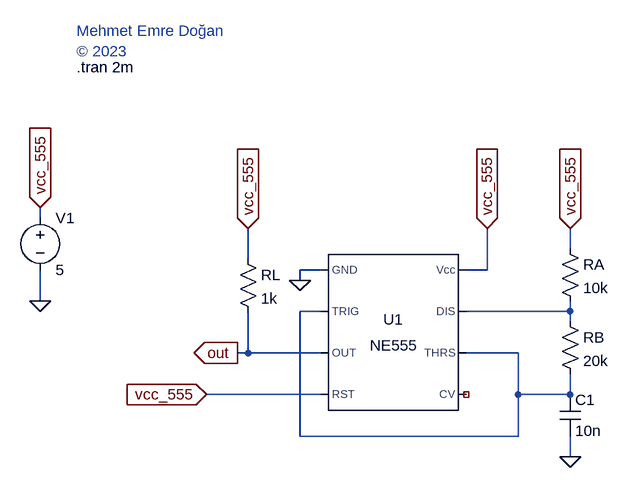
[diagram p0: schematic 555vibrator_10k_20k.asc]
555vibrator_10k_20k.asc, the LTspice schematic file:
Version 4
SHEET 1 880 680
WIRE -304 0 -304 -16
WIRE 512 48 512 16
WIRE 16 64 16 16
WIRE 128 80 96 80
WIRE 384 80 384 16
WIRE 384 80 352 80
WIRE 96 96 96 80
WIRE -304 128 -304 80
WIRE 128 144 96 144
WIRE 512 144 512 128
WIRE 512 144 352 144
WIRE 512 160 512 144
WIRE 16 208 16 144
WIRE 16 208 0 208
WIRE 128 208 16 208
WIRE 432 208 352 208
WIRE 128 272 -48 272
WIRE 432 272 432 208
WIRE 512 272 512 240
WIRE 512 272 432 272
WIRE 96 336 96 144
WIRE 432 336 432 272
WIRE 432 336 96 336
WIRE 512 368 512 336
FLAG -304 128 0
FLAG -304 -16 vcc_555
IOPIN -304 -16 In
FLAG 96 96 0
FLAG 384 16 vcc_555
IOPIN 384 16 In
FLAG 16 16 vcc_555
IOPIN 16 16 In
FLAG 0 208 out
IOPIN 0 208 Out
FLAG -48 272 vcc_555
IOPIN -48 272 In
FLAG 512 368 0
FLAG 512 16 vcc_555
IOPIN 512 16 In
SYMBOL Misc\\NE555 240 176 R0
SYMATTR InstName U1
SYMBOL voltage -304 -16 R0
SYMATTR InstName V1
SYMATTR Value 5
SYMBOL res 0 48 R0
SYMATTR InstName RL
SYMATTR Value 1k
SYMBOL res 496 32 R0
SYMATTR InstName RA
SYMATTR Value 10k
SYMBOL res 496 144 R0
SYMATTR InstName RB
SYMATTR Value 20k
SYMBOL cap 496 272 R0
SYMATTR InstName C1
SYMATTR Value 10n
TEXT -248 -288 Left 2 ;Mehmet Emre Doğan\n© 2023
TEXT -248 -232 Left 2 !.tran 2m

The netlist it stands for:
* 555vibrator_10k_20k.asc
XU1 0 N001 out vcc_555 NC_01 N001 N002 vcc_555 NE555  ; pins GND TRIG OUT RST CV THRS DIS Vcc
V1 vcc_555 0 5
RL vcc_555 out 1k
RA vcc_555 N002 10k
RB N002 N001 20k
C1 N001 0 10n
* Mehmet Emre Doğan
* © 2023
.tran 2m
.lib NE555.sub
.backanno
.end